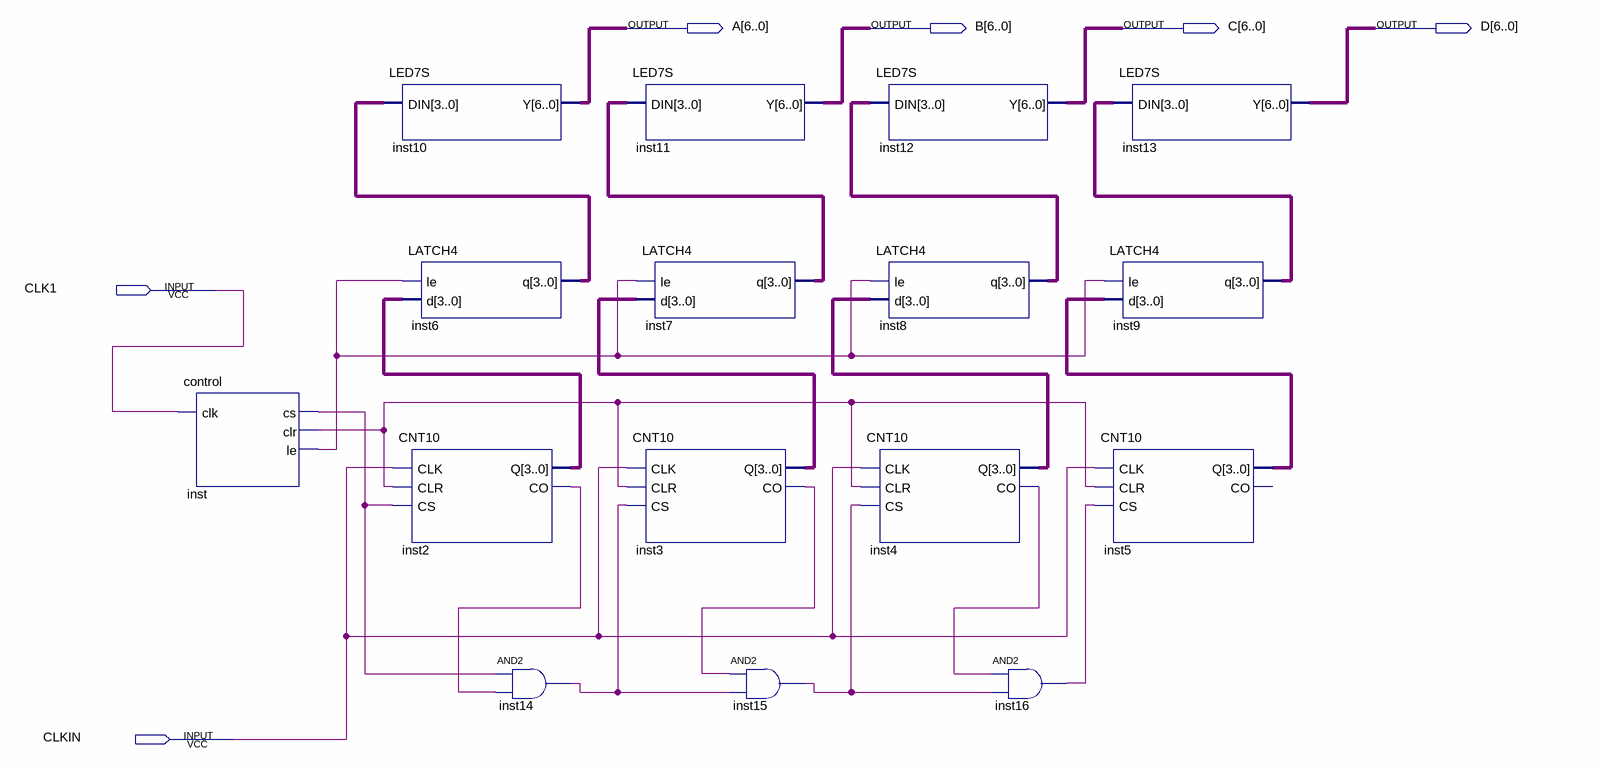
[diagram p0: schematic sheet]
// Quartus schematic FMETER.bdf as structural Verilog: 16 symbols, 6 pins
module FMETER (
  input  CLK1,
  input  CLKIN,
  output [6:0] A,
  output [6:0] B,
  output [6:0] C,
  output [6:0] D
);

  wire inst2_co, inst3_co, inst4_co, inst14_out, inst15_out, inst16_out, inst_clr, inst_cs, inst_le;
  wire [3:0] inst2_q, inst3_q, inst4_q, inst5_q, inst6_q, inst7_q, inst8_q, inst9_q;

  control inst (.clk(CLK1), .cs(inst_cs), .clr(inst_clr), .le(inst_le));
  LED7S inst10 (.DIN(inst6_q), .Y(A));
  LATCH4 inst6 (.le(inst_le), .d(inst2_q), .q(inst6_q));
  CNT10 inst2 (.CLK(CLKIN), .CLR(inst_clr), .CS(inst_cs), .Q(inst2_q), .CO(inst2_co));
  and inst14 (inst14_out, inst_cs, inst2_co);
  LED7S inst11 (.DIN(inst7_q), .Y(B));
  LATCH4 inst7 (.le(inst_le), .d(inst3_q), .q(inst7_q));
  CNT10 inst3 (.CLK(CLKIN), .CLR(inst_clr), .CS(inst14_out), .Q(inst3_q), .CO(inst3_co));
  and inst15 (inst15_out, inst3_co, inst14_out);
  LED7S inst12 (.DIN(inst8_q), .Y(C));
  LATCH4 inst8 (.le(inst_le), .d(inst4_q), .q(inst8_q));
  CNT10 inst4 (.CLK(CLKIN), .CLR(inst_clr), .CS(inst15_out), .Q(inst4_q), .CO(inst4_co));
  and inst16 (inst16_out, inst4_co, inst15_out);
  LATCH4 inst9 (.le(inst_le), .d(inst5_q), .q(inst9_q));
  CNT10 inst5 (.CLK(CLKIN), .CLR(inst_clr), .CS(inst16_out), .Q(inst5_q));  // open: CO
  LED7S inst13 (.DIN(inst9_q), .Y(D));
endmodule
